# Altium schematic sheet Power.SchDoc
size A4; SheetNumber: 6; SheetTotal: 9
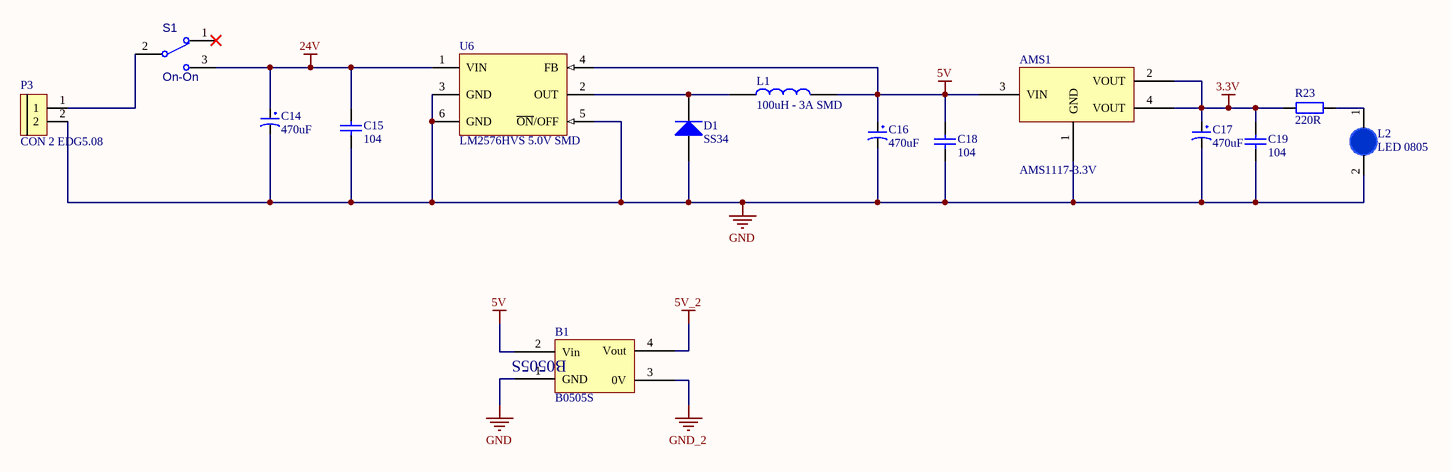
[diagram p0: Power.SchDoc]

## Parts
AMS1  AMS1117-3.3V  [SOT223]
B1  B0505S  [B0505S]
C14  470uF  [tu hoa 10mm]
C15  104  [tu 0603]
C16  470uF  [tu hoa 10mm]
C17  470uF  [tu hoa 10mm]
C18  104  [tu 0603]
C19  104  [tu 0603]
D1  SS34  [DIODE SMA]
L1  100uH - 3A SMD  [Cuon Cam 12x12x10]
L2  LED 0805  [LED-0805-Blue]
P3  CON 2 EDG5.08  [CON 2 2EDG5.08]
R23  220R  [tro smd 0603]
S1  ON-ON  [SWITCH_SPDT_SLIDER]
U6  LM2576HVS 5.0V SMD  [TO263-5]

## Nets
3.3V: AMS1.2(VOUT) AMS1.4(VOUT) C17.1 C19.1 R23.1
5V: AMS1.3(VIN) B1.2(Vin) C16.1 C18.1 L1.2 U6.4(FB)
5V_2: B1.4(Vout)
24V: C14.1 C15.1 S1.3 U6.1(VIN)
GND: AMS1.1(GND) B1.1(GND) C14.2 C15.2 C16.2 C17.2 C18.2 C19.2 D1.1(A) L2.2(K) P3.2 U6.3(GND) U6.5(~{ON}/OFF) U6.6(GND)
GND_2: B1.3(0V)
NetD1_2: D1.2(K) L1.1 U6.2(OUT)
NetL2_1: L2.1(A) R23.2
NetP3_1: P3.1 S1.2

Not connected (* = marked no-connect by the designer): S1 1*

## Library data of the parts
AMS1 = AMS1117 SMD: Dán; Value: AMS1117-3.3V SOT223; Don_Vi: Con; Ma_Hang: MH000596; Ghi_Chu: *; Kieu_Chan: *; Chung_Loai: Dán
B1 = B0505S: Cắm; Ten_Linh_Kien: B0505S-1W SIP4 IC Converter DC-DC; Don_Vi: Con; Ma_Hang: MH003143; Ghi_Chu: *; Kieu_Chan: *; Chung_Loai: Cắm
C14 C16 C17 = Tu Hoa 470uF 35V 10x15: Cắm; Don_Vi: Con; So_Chan: 2; Ten_Linh_Kien: Tụ Hóa 470uF 35V 10x15MM; Ma_Hang: MH002204; Chung_Loai: Cắm; Kieu_Chan: *
C15 C18 C19 = Tu 0603 104 50V 10%: Dán; Don_Vi: Con; So_Chan: 2; Ten_Linh_Kien: Tụ 0603 104-100nF 10% 50V; Ma_Hang: MH004568; Chung_Loai: Dán; Kieu_Chan: *
D1 = Diode SS34 ( 1N5822 ): Dán; Don_Vi: Con; Ma_Hang: MH002104; Ten_Linh_Kien: Diode SS34 3A 40V SMA ( 1N5822 SS34A); Kieu_Chan: *; Chung_Loai: Dán
L1 = CUON CAM 100uH SMD: Dán; Don_Vi: Con; Ma_Hang: MH003999; Ten_Linh_Kien: Cuộn Cảm 100uH 7x7x4MM CD74; Ma_Hang: *; Kieu_Chan: *; Chung_Loai: Dán
L2 = LED 0805 Xanh Duong: Dán; Don_Vi: Con; Ma_Hang: MH002327; Ten_Linh_Kien: LED 0805 Màu Xanh Dương (Blue); Ghi_Chu: *; Kieu_Chan: *; Chung_Loai: Dán
P3 = CON 2 EDG5.08: Cắm; Ten_Linh_Kien: CON 2 2EDG5.08-2P 5.08MM ( Xanh Cong); Ma_Hang: MH000759; Ghi_Chu: *; Don_Vi: Con; Kieu_Chan: *; Chung_Loai: Cắm
R23 = Tro 0603 5% 220R: Dán; Don_Vi: Con; So_Chan: 2; Ten_Linh_Kien: Trở 0603 5% 220R; Ma_Hang: MH006322; Chung_Loai: Dán; Kieu_Chan: *
S1 = SW_THD_SPDT_On-On: Switch THD vertical toggle SPDT; Manufacturer 1: TE Connectivity; Manufacturer Part Number 1: SLS121PC04; Contact Rating @ Voltage: 0.25A @ 125VAC; SCDType: spec; Circuit: SPDT; Mounting Type: PCB mount; Supplier 1: Digi-Key; Supplier Part Number 1: 450-1598-ND; Switch Function: On-On
U6 = LM2576HVS 5.0V SMD: Dán; Ten_Linh_Kien: LM2576HVS-5.0V BUCK 5V 3A TO263-5; Don_Vi: Con; Ma_Hang: MH002362; Ghi_Chu: *; Kieu_Chan: *; Chung_Loai: Dán